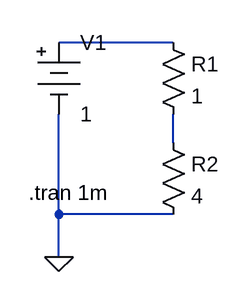
[diagram p0: schematic Yoneda-p38.asc]
Yoneda-p38.asc, the LTspice schematic file:
Version 4
SHEET 1 880 680
WIRE 160 48 32 48
WIRE 160 160 160 128
WIRE 32 240 32 128
WIRE 160 240 32 240
WIRE 32 288 32 240
FLAG 32 288 0
SYMBOL res 144 32 R0
SYMATTR InstName R1
SYMATTR Value 1
SYMBOL Misc\\battery 32 32 R0
WINDOW 123 0 0 Left 2
WINDOW 39 0 0 Left 2
SYMATTR InstName V1
SYMATTR Value 1
SYMBOL res 144 144 R0
SYMATTR InstName R2
SYMATTR Value 4
TEXT -2 216 Left 2 !.tran 1m

The netlist it stands for:
* Yoneda-p38.asc
R1 N001 N002 1
V1 N001 0 1
R2 N002 0 4
.tran 1m
.backanno
.end